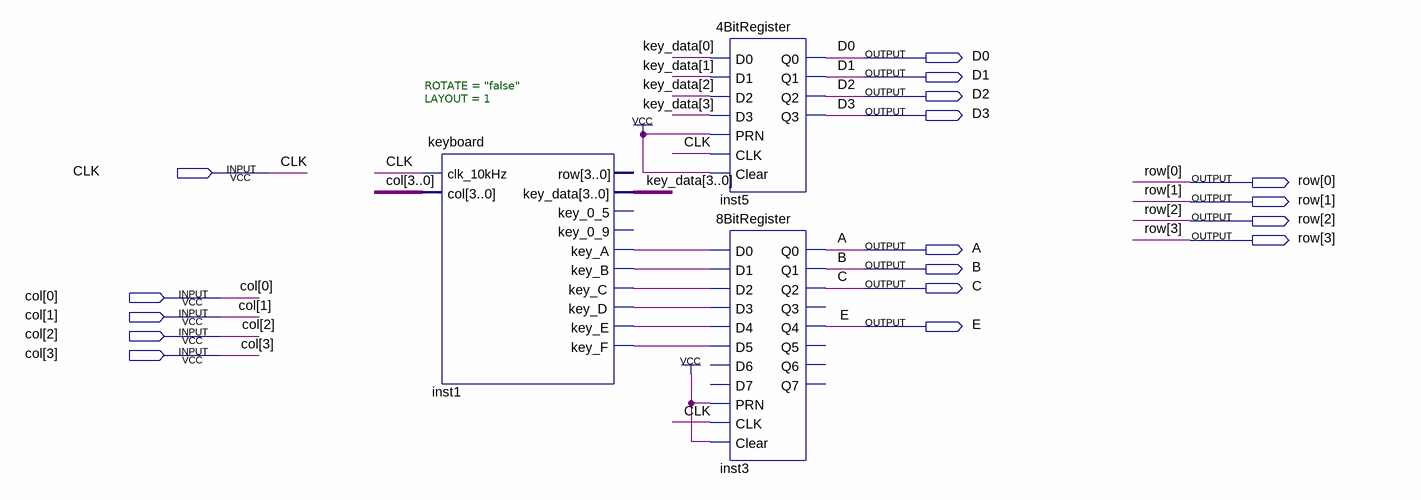
[diagram p0: schematic sheet]
// Quartus schematic key.bdf as structural Verilog: 3 symbols, 17 pins
module key (
  input  CLK,
  input  [3:0] col,
  output D0,
  output D1,
  output D2,
  output D3,
  output [3:0] row,
  output A,
  output B,
  output C,
  output E
);

  wire inst1_key_a, inst1_key_b, inst1_key_c, inst1_key_d, inst1_key_e, inst1_key_f;
  wire [3:0] key_data;

  keyboard #(.ROTATE("false"), .LAYOUT(1)) inst1 (
    .clk_10kHz(CLK), .col(col), .key_data(key_data), .key_A(inst1_key_a), .key_B(inst1_key_b),
    .key_C(inst1_key_c), .key_D(inst1_key_d), .key_E(inst1_key_e), .key_F(inst1_key_f));  // open: row, key_0_5, key_0_9
  \4BitRegister  inst5 (
    .D0(key_data[0]), .D1(key_data[1]), .D2(key_data[2]), .D3(key_data[3]), .PRN(1'b1), .CLK(CLK),
    .Clear(1'b1), .Q0(D0), .Q1(D1), .Q2(D2), .Q3(D3));
  \8BitRegister  inst3 (
    .D0(inst1_key_a), .D1(inst1_key_b), .D2(inst1_key_c), .D3(inst1_key_d), .D4(inst1_key_e),
    .D5(inst1_key_f), .PRN(1'b1), .CLK(CLK), .Clear(1'b1), .Q0(A), .Q1(B), .Q2(C), .Q4(E));  // open: D6, D7, Q3, Q5, Q6, Q7
endmodule
